# EAGLE design PixelPusherV0 (EAGLE 9.6.2)
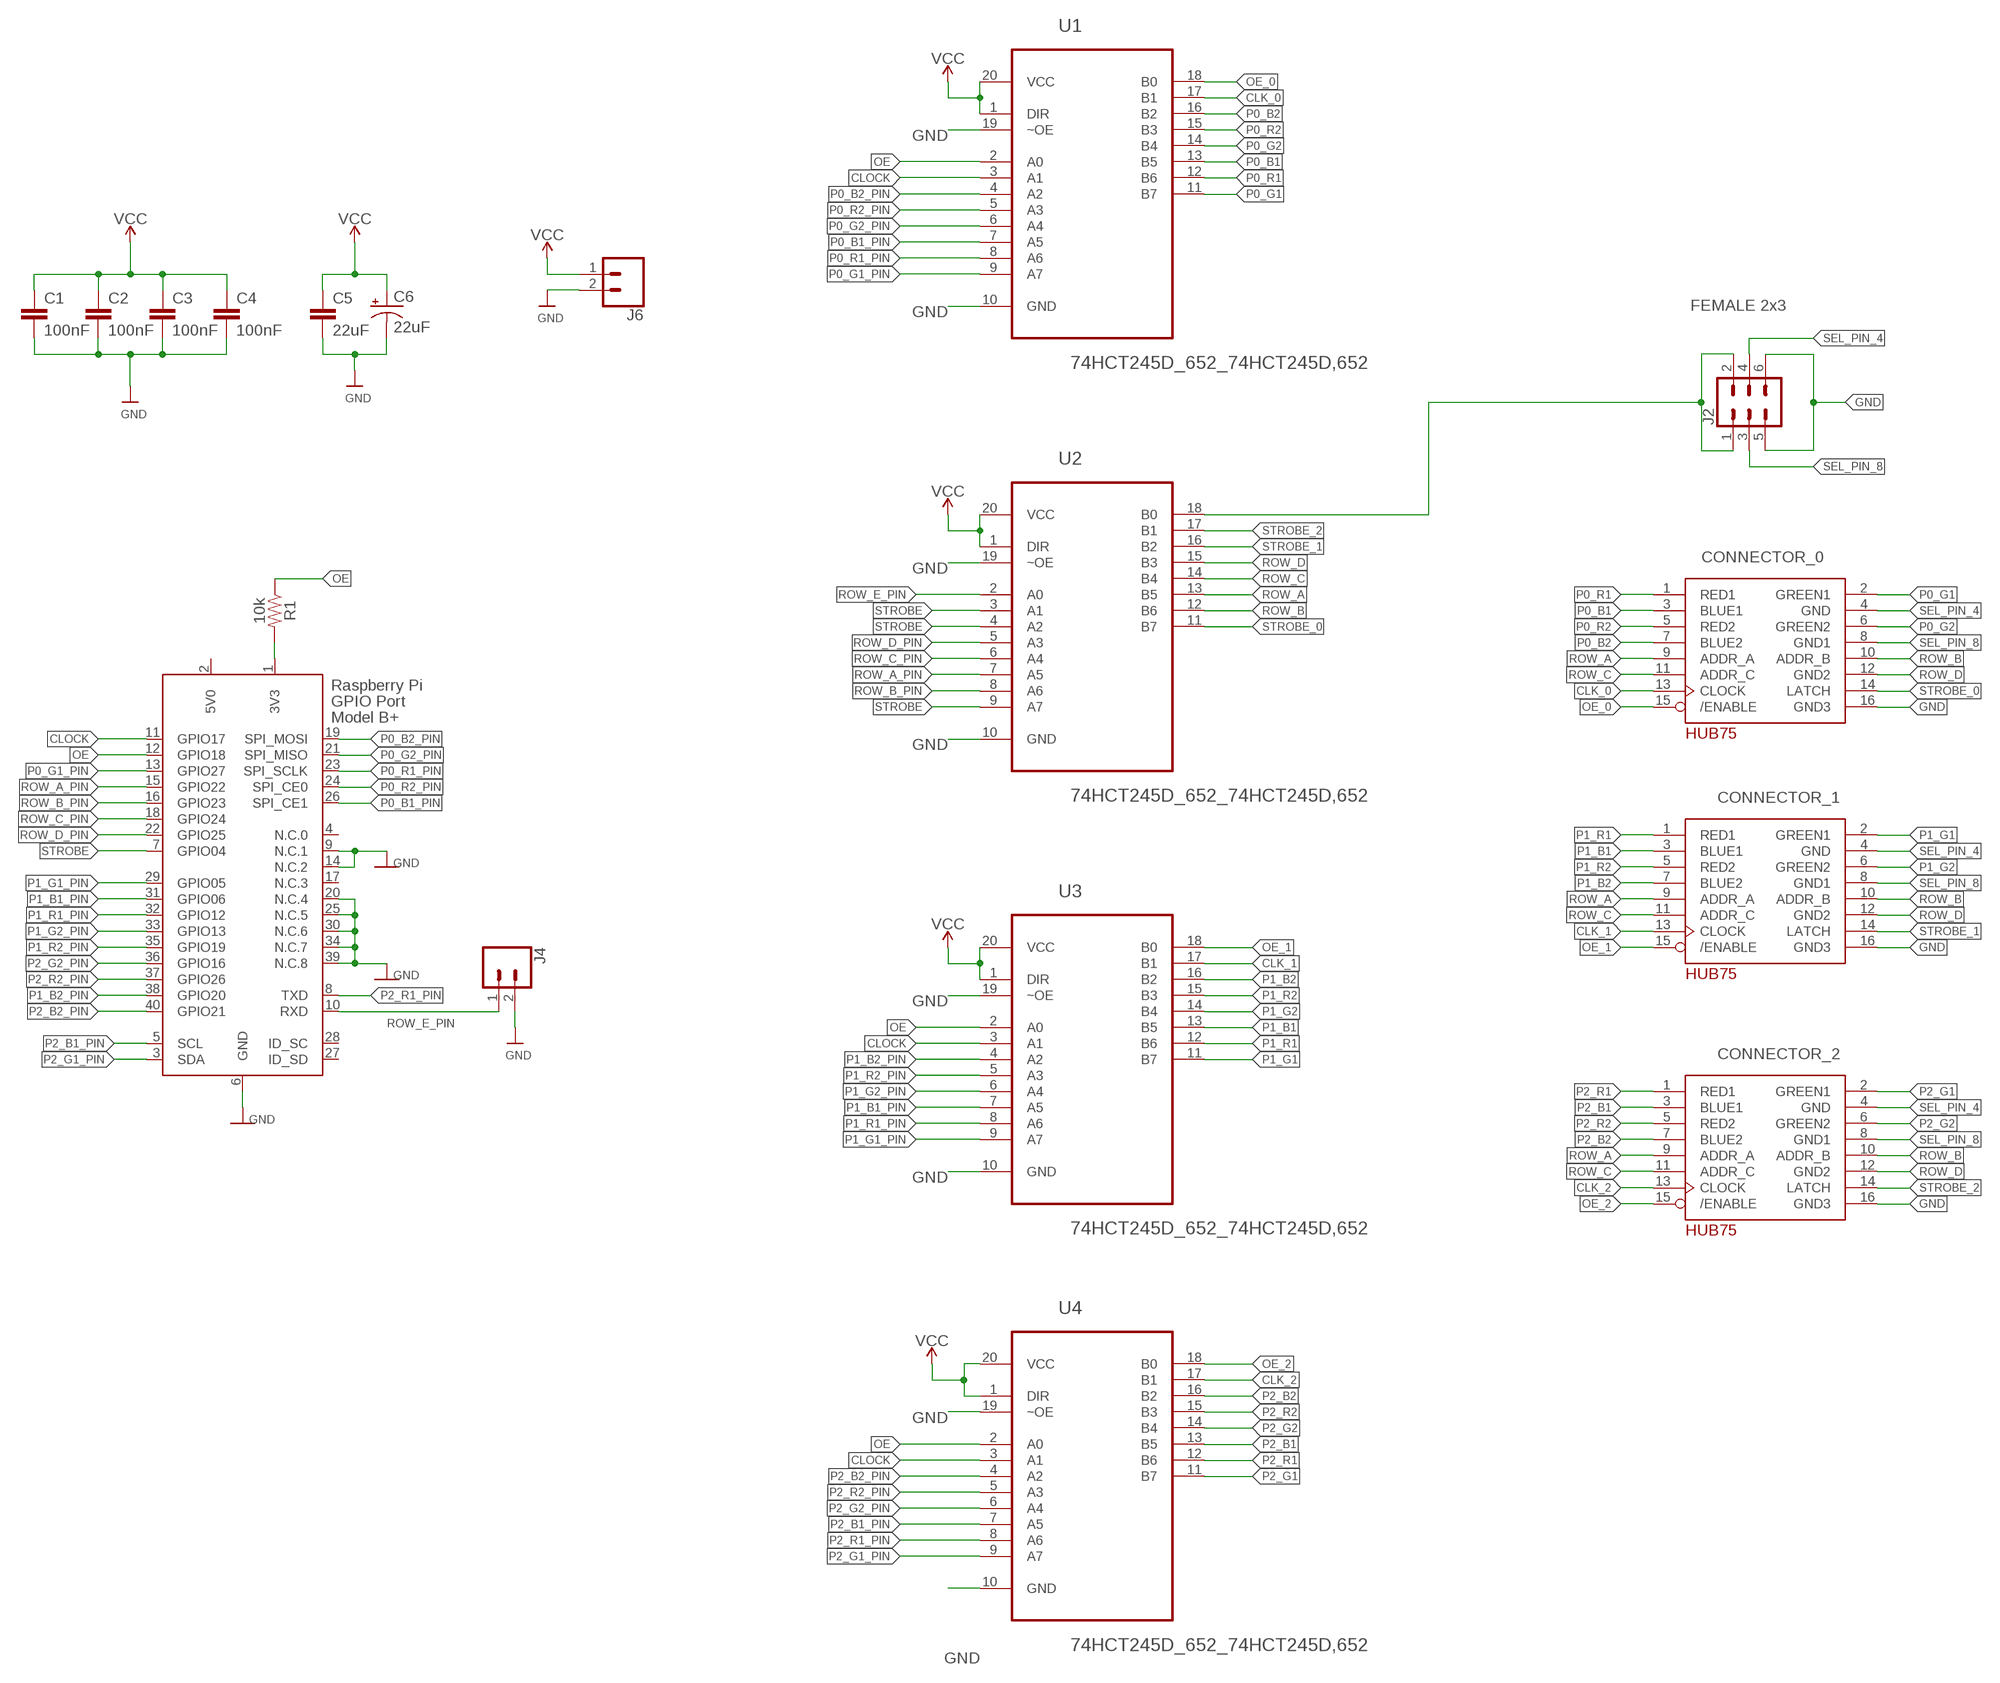
[diagram p0: schematic, sheet 1]

## Parts
C1  100nF  SPARKFUN-CAPACITORS_0.1UF-0603-25V-(+80/-20%)  [SPARKFUN-CAPACITORS_0603]
C2  100nF  SPARKFUN-CAPACITORS_0.1UF-0603-25V-(+80/-20%)  [SPARKFUN-CAPACITORS_0603]
C3  100nF  SPARKFUN-CAPACITORS_0.1UF-0603-25V-(+80/-20%)  [SPARKFUN-CAPACITORS_0603]
C4  100nF  SPARKFUN-CAPACITORS_0.1UF-0603-25V-(+80/-20%)  [SPARKFUN-CAPACITORS_0603]
C5  22uF  SPARKFUN-CAPACITORS_22UF-0805-6.3V-20%  [SPARKFUN-CAPACITORS_0805]
C6  22uF  SPARKFUN-CAPACITORS_22UF-POLAR-PANASONIC_C-35V-20%  [SPARKFUN-CAPACITORS_PANASONIC_C]
CONNECTOR_0  ADAFRUIT_HUB75MATRIX  [ADAFRUIT_2X08-IDC]
CONNECTOR_1  ADAFRUIT_HUB75MATRIX  [ADAFRUIT_2X08-IDC]
CONNECTOR_2  ADAFRUIT_HUB75MATRIX  [ADAFRUIT_2X08-IDC]
J2  FEMALE 2x3  SPARKFUN-CONNECTORS_CONN_03X2FEMALE  [SPARKFUN-CONNECTORS_2X3]
J4  SPARKFUN-CONNECTORS_CONN_02  [SPARKFUN-CONNECTORS_1X02]
J6  SPARKFUN-CONNECTORS_CONN_023.5MM_LOCK  [SPARKFUN-CONNECTORS_SCREWTERMINAL-3.5MM-2_LOCK]
R1  10k  SPARKFUN-RESISTORS_10KOHM-0603-1/10W-1%  [SPARKFUN-RESISTORS_0603:1]
U1  74HCT245D_652_74HCT245D,652  [74HCT245D_652_SOIC127P1032X265-20N]
U2  74HCT245D_652_74HCT245D,652  [74HCT245D_652_SOIC127P1032X265-20N]
U3  74HCT245D_652_74HCT245D,652  [74HCT245D_652_SOIC127P1032X265-20N]
U4  74HCT245D_652_74HCT245D,652  [74HCT245D_652_SOIC127P1032X265-20N]
X2  RASPBERRYPI_BASTELSTUBE_V13_RASPI_BOARD_B+_HD  [RASPBERRYPI_BASTELSTUBE_V13_RASPI_BOARD_B+HAT_DF]

## Nets
CLK_0: CONNECTOR_0.13(CLOCK) U1.17(B1)
CLK_1: CONNECTOR_1.13(CLOCK) U3.17(B1)
CLK_2: CONNECTOR_2.13(CLOCK) U4.17(B1)
CLOCK: U1.3(A1) U3.3(A1) U4.3(A1) X2.11(GPIO17)
GND: C1.2 C2.2 C3.2 C4.2 C5.2 C6.- CONNECTOR_0.16(GND3) CONNECTOR_1.16(GND3) CONNECTOR_2.16(GND3) J2.5 J2.6 J4.2 J6.2 U1.10(GND) U1.19(~OE) U2.10(GND) U2.19(~OE) U3.10(GND) U3.19(~OE) U4.10(GND) U4.19(~OE) X2.6(GND) X2.9(N.C.1) X2.14(N.C.2) X2.20(N.C.4) X2.25(N.C.5) X2.30(N.C.6) X2.34(N.C.7) X2.39(N.C.8)
N$1: J2.1 J2.2 U2.18(B0)
N$2: R1.2 X2.1(3V3)
OE: R1.1 U1.2(A0) U3.2(A0) U4.2(A0) X2.12(GPIO18)
OE_0: CONNECTOR_0.15(/ENABLE) U1.18(B0)
OE_1: CONNECTOR_1.15(/ENABLE) U3.18(B0)
OE_2: CONNECTOR_2.15(/ENABLE) U4.18(B0)
P0_B1: CONNECTOR_0.3(BLUE1) U1.13(B5)
P0_B1_PIN: U1.7(A5) X2.26(SPI_CE1)
P0_B2: CONNECTOR_0.7(BLUE2) U1.16(B2)
P0_B2_PIN: U1.4(A2) X2.19(SPI_MOSI)
P0_G1: CONNECTOR_0.2(GREEN1) U1.11(B7)
P0_G1_PIN: U1.9(A7) X2.13(GPIO27)
P0_G2: CONNECTOR_0.6(GREEN2) U1.14(B4)
P0_G2_PIN: U1.6(A4) X2.21(SPI_MISO)
P0_R1: CONNECTOR_0.1(RED1) U1.12(B6)
P0_R1_PIN: U1.8(A6) X2.23(SPI_SCLK)
P0_R2: CONNECTOR_0.5(RED2) U1.15(B3)
P0_R2_PIN: U1.5(A3) X2.24(SPI_CE0)
P1_B1: CONNECTOR_1.3(BLUE1) U3.13(B5)
P1_B1_PIN: U3.7(A5) X2.31(GPIO06)
P1_B2: CONNECTOR_1.7(BLUE2) U3.16(B2)
P1_B2_PIN: U3.4(A2) X2.38(GPIO20)
P1_G1: CONNECTOR_1.2(GREEN1) U3.11(B7)
P1_G1_PIN: U3.9(A7) X2.29(GPIO05)
P1_G2: CONNECTOR_1.6(GREEN2) U3.14(B4)
P1_G2_PIN: U3.6(A4) X2.33(GPIO13)
P1_R1: CONNECTOR_1.1(RED1) U3.12(B6)
P1_R1_PIN: U3.8(A6) X2.32(GPIO12)
P1_R2: CONNECTOR_1.5(RED2) U3.15(B3)
P1_R2_PIN: U3.5(A3) X2.35(GPIO19)
P2_B1: CONNECTOR_2.3(BLUE1) U4.13(B5)
P2_B1_PIN: U4.7(A5) X2.5(SCL)
P2_B2: CONNECTOR_2.7(BLUE2) U4.16(B2)
P2_B2_PIN: U4.4(A2) X2.40(GPIO21)
P2_G1: CONNECTOR_2.2(GREEN1) U4.11(B7)
P2_G1_PIN: U4.9(A7) X2.3(SDA)
P2_G2: CONNECTOR_2.6(GREEN2) U4.14(B4)
P2_G2_PIN: U4.6(A4) X2.36(GPIO16)
P2_R1: CONNECTOR_2.1(RED1) U4.12(B6)
P2_R1_PIN: U4.8(A6) X2.8(TXD)
P2_R2: CONNECTOR_2.5(RED2) U4.15(B3)
P2_R2_PIN: U4.5(A3) X2.37(GPIO26)
ROW_A: CONNECTOR_0.9(ADDR_A) CONNECTOR_1.9(ADDR_A) CONNECTOR_2.9(ADDR_A) U2.13(B5)
ROW_A_PIN: U2.7(A5) X2.15(GPIO22)
ROW_B: CONNECTOR_0.10(ADDR_B) CONNECTOR_1.10(ADDR_B) CONNECTOR_2.10(ADDR_B) U2.12(B6)
ROW_B_PIN: U2.8(A6) X2.16(GPIO23)
ROW_C: CONNECTOR_0.11(ADDR_C) CONNECTOR_1.11(ADDR_C) CONNECTOR_2.11(ADDR_C) U2.14(B4)
ROW_C_PIN: U2.6(A4) X2.18(GPIO24)
ROW_D: CONNECTOR_0.12(GND2) CONNECTOR_1.12(GND2) CONNECTOR_2.12(GND2) U2.15(B3)
ROW_D_PIN: U2.5(A3) X2.22(GPIO25)
ROW_E_PIN: J4.1 U2.2(A0) X2.10(RXD)
SEL_PIN_4: CONNECTOR_0.4(GND) CONNECTOR_1.4(GND) CONNECTOR_2.4(GND) J2.4
SEL_PIN_8: CONNECTOR_0.8(GND1) CONNECTOR_1.8(GND1) CONNECTOR_2.8(GND1) J2.3
STROBE: U2.3(A1) U2.4(A2) U2.9(A7) X2.7(GPIO04)
STROBE_0: CONNECTOR_0.14(LATCH) U2.11(B7)
STROBE_1: CONNECTOR_1.14(LATCH) U2.16(B2)
STROBE_2: CONNECTOR_2.14(LATCH) U2.17(B1)
VCC: C1.1 C2.1 C3.1 C4.1 C5.1 C6.+ J6.1 U1.1(DIR) U1.20(VCC) U2.1(DIR) U2.20(VCC) U3.1(DIR) U3.20(VCC) U4.1(DIR) U4.20(VCC)
Unconnected: X2.4(N.C.0) X2.17(N.C.3) X2.27(ID_SD) X2.28(ID_SC)

## Power pins joined to a net without a drawn wire
5V0: X2.2(5V0)

## Library data of the parts
C1-C4 = PixelPusherV0:SPARKFUN-CAPACITORS_0.1UF: 0.1µF ceramic capacitors A capacitor is a passive two-terminal electrical component used to store electrical energy temporarily in an electric field.; PROD_ID: CAP-00810; VALUE: 0.1uF
C5 = PixelPusherV0:SPARKFUN-CAPACITORS_22UF: 22µF ceramic capacitors A capacitor is a passive two-terminal electrical component used to store electrical energy temporarily in an electric field.; PROD_ID: CAP-08402
C6 = PixelPusherV0:SPARKFUN-CAPACITORS_22UF-POLAR: 22µF polarized capacitors A capacitor is a passive two-terminal electrical component used to store electrical energy temporarily in an electric field.; PROD_ID: CAP-08618
CONNECTOR_0 CONNECTOR_1 CONNECTOR_2 = PixelPusherV0:ADAFRUIT_HUB75MATRIX
J2 = PixelPusherV0:SPARKFUN-CONNECTORS_CONN_03X2: Multi connection point. Often used as Generic Header-pin footprint for 0.1 inch spaced/style header connections You can populate with any combo of single row headers, but if you'd like an exact match, check these: Header - 2x3 (Male, 0.1") <https://www.sparkfun.com/products/12807> (PRT-12807) Header - 2x3 (Female, 0.1") <https://www.sparkfun.com/products/13010> (PRT-13010) 2x3 Pin Shrouded Header <https://www.sparkfun.com/products/10877> (PRT-10877) On any of the 0.1 inch spaced packages, you can populate with these: Break Away Headers - Straight <https://www.sparkfun.com/products/116> (PRT-00116) Break Away Male Headers - Right Angle <https://www.sparkfun.com/products/553> (PRT-00553) Female Headers <https://www.sparkfun.com/products/115> (PRT-00115) Break Away Headers - Machine Pin <https://www.sparkfun.com/products/117> (PRT-00117) Break Away Female Headers - Swiss Machine Pin <https://www.sparkfun.com/products/743> (PRT-00743) Special note: the shrouded connector mates well with our 3x2 ribbon cables: Ribbon Crimp Connector - 6-pin (2x3, Female) <https://www.sparkfun.com/products/10651> (PRT-10651) Ribbon Cable - 6 wire (15ft) <https://www.sparkfun.com/products/10646> (PRT-10646); PROD_ID: CONN-11566
J4 = PixelPusherV0:SPARKFUN-CONNECTORS_CONN_02: Multi connection point. Often used as Generic Header-pin footprint for 0.1 inch spaced/style header connections On any of the 0.1 inch spaced packages, you can populate with these: Break Away Headers - Straight <https://www.sparkfun.com/products/116> (PRT-00116) Break Away Male Headers - Right Angle <https://www.sparkfun.com/products/553> (PRT-00553) Female Headers <https://www.sparkfun.com/products/115> (PRT-00115) Break Away Headers - Machine Pin <https://www.sparkfun.com/products/117> (PRT-00117) Break Away Female Headers - Swiss Machine Pin <https://www.sparkfun.com/products/743> (PRT-00743) For SCREWTERMINALS and SPRING TERMINALS visit here: Screw Terimnals on SparkFun.com <https://www.sparkfun.com/search/results?term=Screw+Terminals> (5mm/3.5mm/2.54mm spacing) This device is also useful as a general connection point to wire up your design to another part of your project. Our various solder wires solder well into these plated through hole pads. Hook-Up Wire - Assortment (Stranded, 22 AWG) <https://www.sparkfun.com/products/11375> (PRT-11375) Hook-Up Wire - Assortment (Solid Core, 22 AWG) <https://www.sparkfun.com/products/11367> (PRT-11367) View the entire wire category on our website here <https://www.sparkfun.com/categories/141> Special notes: Molex polarized connector foot print use with: PRT-08233 with associated crimp pins and housings. 2.54_SCREWTERM for use with PRT-10571. 3.5mm Screw Terminal footprints for PRT-08084 5mm Screw Terminal footprints for use with PRT-08432
J6 = PixelPusherV0:SPARKFUN-CONNECTORS_CONN_02: Multi connection point. Often used as Generic Header-pin footprint for 0.1 inch spaced/style header connections On any of the 0.1 inch spaced packages, you can populate with these: Break Away Headers - Straight <https://www.sparkfun.com/products/116> (PRT-00116) Break Away Male Headers - Right Angle <https://www.sparkfun.com/products/553> (PRT-00553) Female Headers <https://www.sparkfun.com/products/115> (PRT-00115) Break Away Headers - Machine Pin <https://www.sparkfun.com/products/117> (PRT-00117) Break Away Female Headers - Swiss Machine Pin <https://www.sparkfun.com/products/743> (PRT-00743) For SCREWTERMINALS and SPRING TERMINALS visit here: Screw Terimnals on SparkFun.com <https://www.sparkfun.com/search/results?term=Screw+Terminals> (5mm/3.5mm/2.54mm spacing) This device is also useful as a general connection point to wire up your design to another part of your project. Our various solder wires solder well into these plated through hole pads. Hook-Up Wire - Assortment (Stranded, 22 AWG) <https://www.sparkfun.com/products/11375> (PRT-11375) Hook-Up Wire - Assortment (Solid Core, 22 AWG) <https://www.sparkfun.com/products/11367> (PRT-11367) View the entire wire category on our website here <https://www.sparkfun.com/categories/141> Special notes: Molex polarized connector foot print use with: PRT-08233 with associated crimp pins and housings. 2.54_SCREWTERM for use with PRT-10571. 3.5mm Screw Terminal footprints for PRT-08084 5mm Screw Terminal footprints for use with PRT-08432; PROD_ID: CONN-08399
R1 = PixelPusherV0:SPARKFUN-RESISTORS_10KOHM: 10kΩ resistor A resistor is a passive two-terminal electrical component that implements electrical resistance as a circuit element. Resistors act to reduce current flow, and, at the same time, act to lower voltage levels within circuits. - Wikipedia; PROD_ID: RES-00824
U1-U4 = PixelPusherV0:74HCT245D_652_74HCT245D,652: Octal bus transceiver Check prices <https://pricing.snapeda.com/parts/74HCT245D%2C652/Nexperia/view-part?ref=eda>; AVAILABILITY: In Stock; DESCRIPTION: Transceiver, Non-Inverting 1 Element 8 Bit per Element 3-State Output 20-SO; MF: Nexperia; MP: 74HCT245D,652; PACKAGE: SO20-20 Nexperia USA Inc.; PRICE: None
X2 = PixelPusherV0:RASPBERRYPI_BASTELSTUBE_V13_RASPI_BOARD_B+: Raspberry Pi GPIO connector with markings for the outer dimensions of the Raspberry Pi board model B+ with different sets of drill holes or mounting pads

## Board
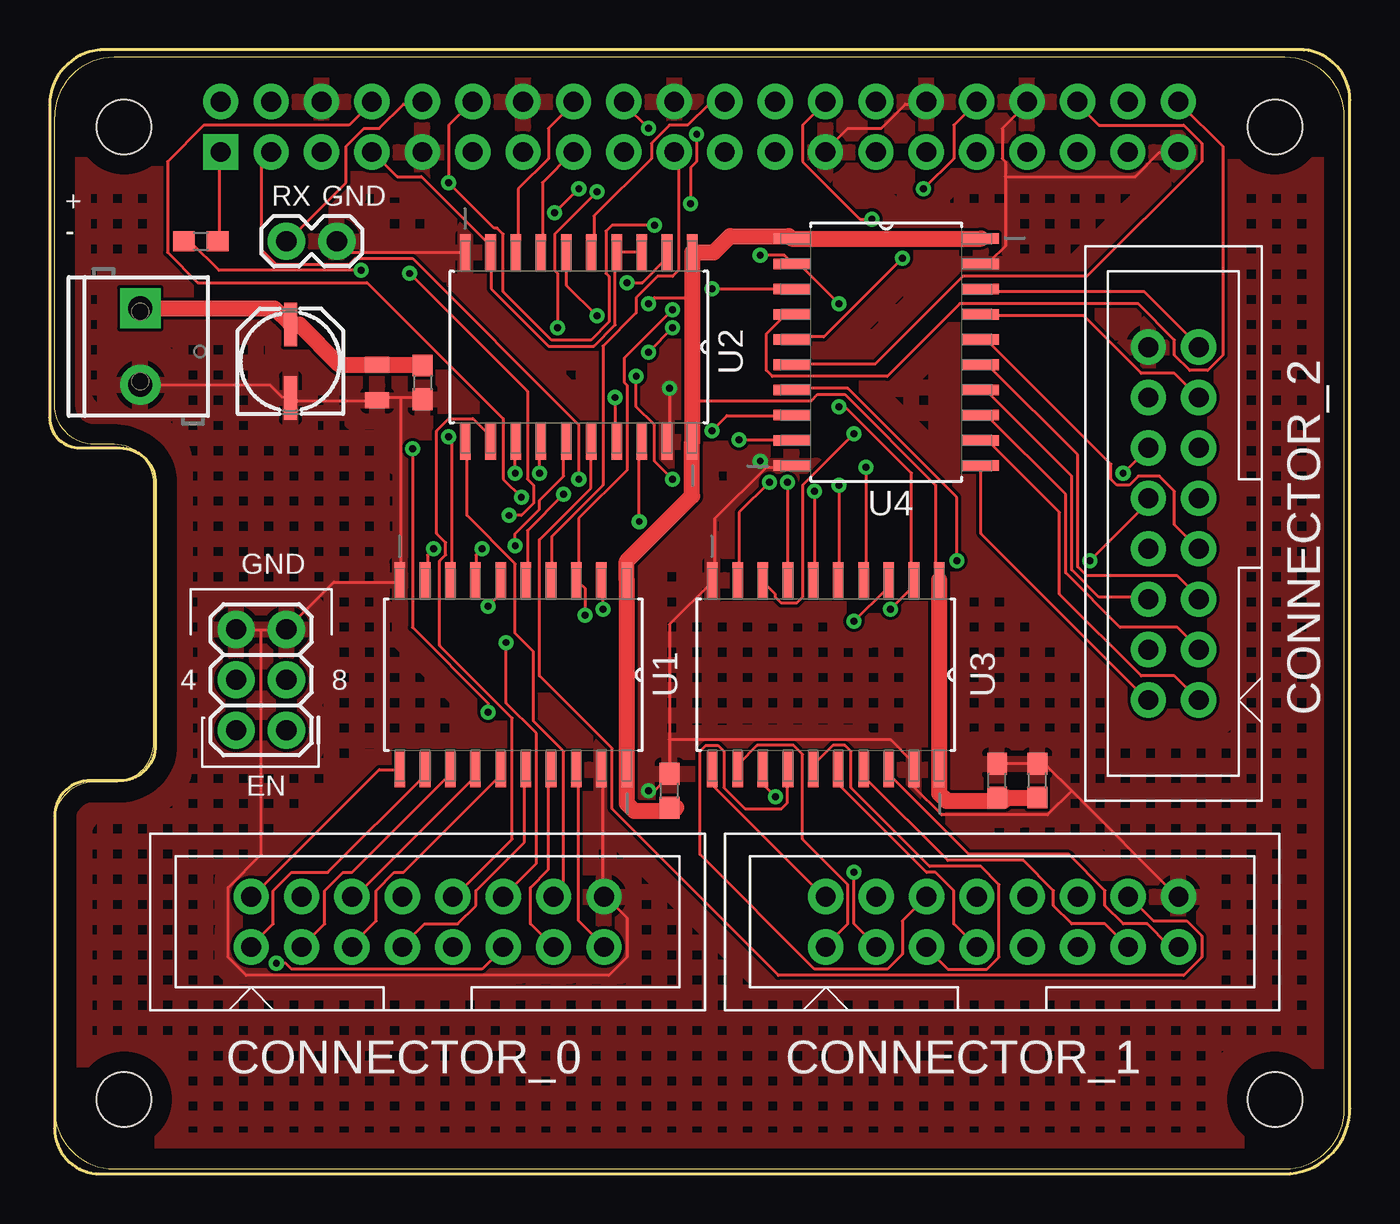
[diagram p1: board, top side]
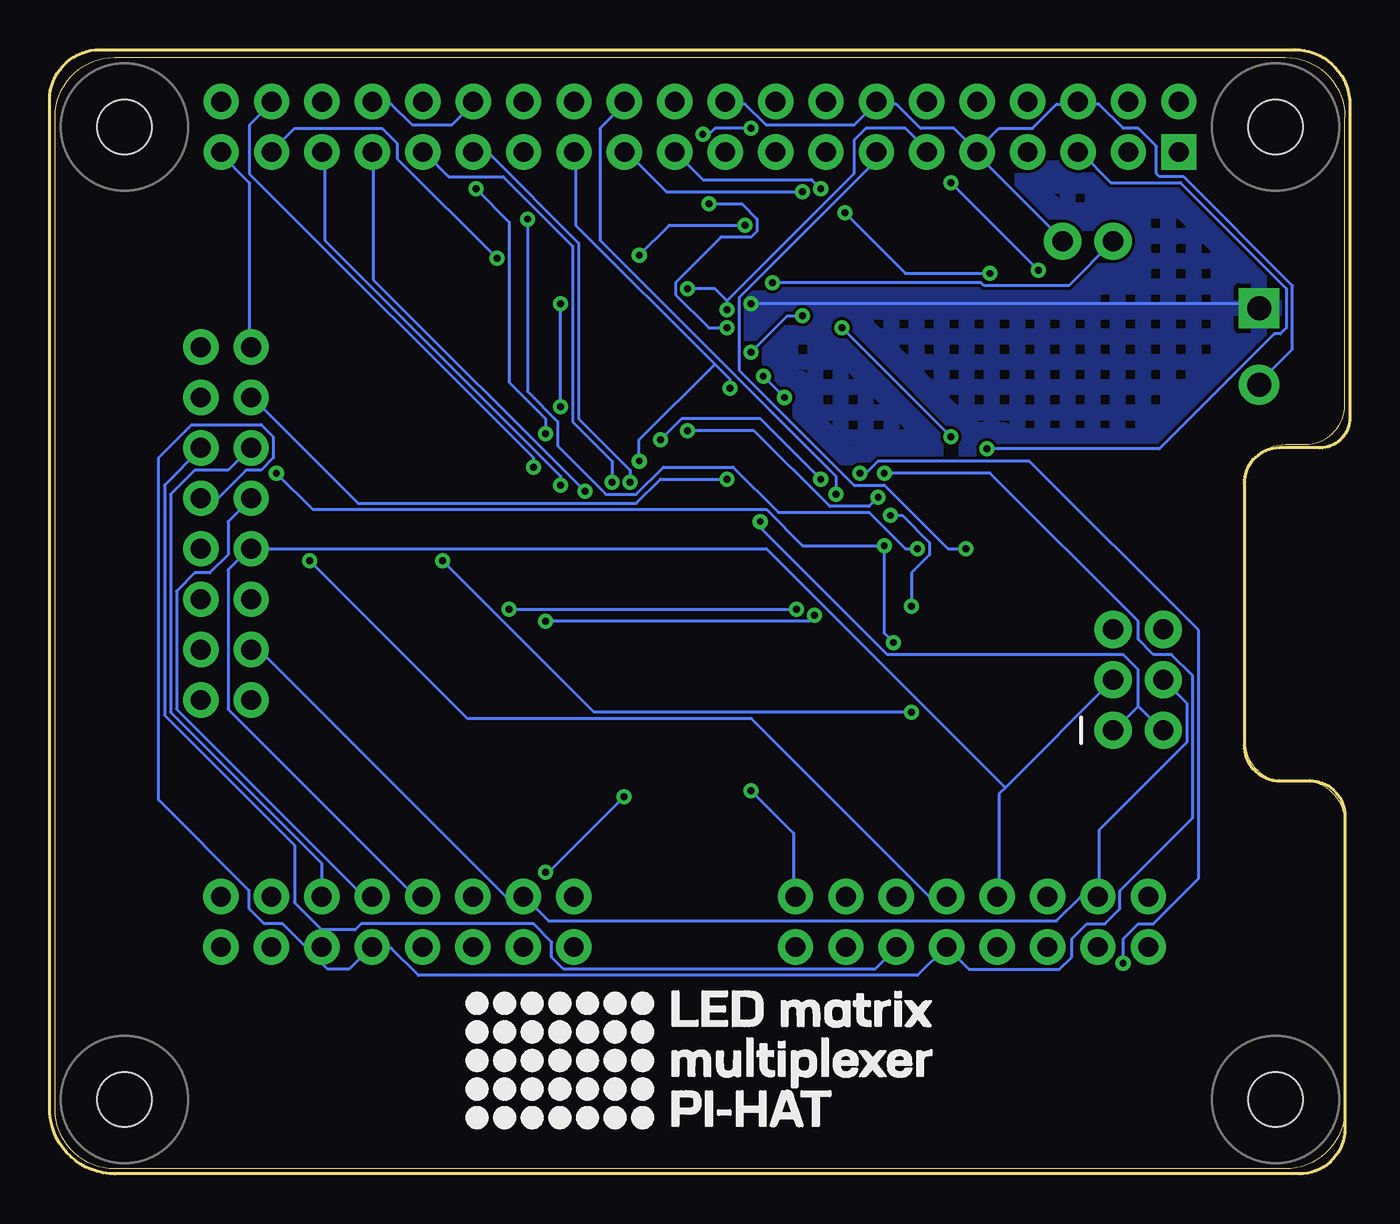
[diagram p2: board, bottom side, seen from below]

Size 65.53 x 56.64 mm. Coordinates in mm from the lower left corner, seen from the top.
Outline: 2.54,0 62.23,0 arc90 65.53,3.3 65.53,54.1 arc90 62.99,56.64 2.79,56.64 arc90 0,53.85 0,38.1 arc90 1.52,36.58 3.56,36.58 arc-90 5.33,34.8 5.33,21.59 arc-90 3.56,19.81 2.03,19.81 arc90 0.25,18.03 0.25,2.29 arc90 2.54,0
Copper layers (1*16): Top 0.035mm / dielectric 1.5mm / Bottom 0.035mm
Design rules "default *": minimum track width 6mil, minimum drill 0.35mm, track to track 6mil, track to pad 6mil, pad to pad 6mil, via to via 6mil, smd to smd 6mil, copper to edge 40mil, drill to drill 6mil, minimum pad ring 10mil, minimum via ring 8mil, stop-mask expansion 4mil, vias tented up to drill 0.35mm, thermal gap 10mil

### Footprints (pad centres in the part's own frame; a part is rotated, then mirrored left to right if it is on the bottom)
SPARKFUN-CAPACITORS_0603 = smd 1.1 x 1: 1 -0.85,0; 2 0.85,0
SPARKFUN-CAPACITORS_0805 = smd 0.8 x 1.2: 1 -0.9,0; 2 0.9,0
SPARKFUN-CAPACITORS_PANASONIC_C = smd 2.2 x 0.65: + 1.9,-0.2; - -1.8,-0.2
ADAFRUIT_2X08-IDC = drill 1 pad 1.778: 1 -1.27,8.89; 2 1.27,8.89; 3 -1.27,6.35; 4 1.27,6.35; 5 -1.27,3.81; 6 1.27,3.81; 7 -1.27,1.27; 8 1.27,1.27; 9 -1.27,-1.27; 10 1.27,-1.27; 11 -1.27,-3.81; 12 1.27,-3.81; 13 -1.27,-6.35; 14 1.27,-6.35; 15 -1.27,-8.89; 16 1.27,-8.89
SPARKFUN-CONNECTORS_2X3 = drill 1.016 pad 1.88: 1 0,0; 2 0,2.54; 3 2.54,0; 4 2.54,2.54; 5 5.08,0; 6 5.08,2.54
SPARKFUN-CONNECTORS_1X02 = drill 1.016 pad 1.88: 1 0,0; 2 2.54,0
SPARKFUN-CONNECTORS_SCREWTERMINAL-3.5MM-2_LOCK = drill 1.2 pad 2.032 square: 1 -0.178,0 | drill 1.2 pad 2.032: 2 3.678,0
SPARKFUN-RESISTORS_0603:1 = smd 1.1 x 1: 1 -0.85,0; 2 0.85,0
74HCT245D_652_SOIC127P1032X265-20N = smd 1.803 x 0.533: 1 -4.775,5.715; 2 -4.775,4.445; 3 -4.775,3.175; 4 -4.775,1.905; 5 -4.775,0.635; 6 -4.775,-0.635; 7 -4.775,-1.905; 8 -4.775,-3.175; 9 -4.775,-4.445; 10 -4.775,-5.715; 11 4.775,-5.715; 12 4.775,-4.445; 13 4.775,-3.175; 14 4.775,-1.905; 15 4.775,-0.635; 16 4.775,0.635; 17 4.775,1.905; 18 4.775,3.175; 19 4.775,4.445; 20 4.775,5.715
RASPBERRYPI_BASTELSTUBE_V13_RASPI_BOARD_B+HAT_DF = drill 1 pad 1.778 square: 1 8.37,51.23 | drill 1 pad 1.778: 2 8.37,53.77; 3 10.91,51.23; 4 10.91,53.77; 5 13.45,51.23; 6 13.45,53.77; 7 15.99,51.23; 8 15.99,53.77; 9 18.53,51.23; 10 18.53,53.77; 11 21.07,51.23; 12 21.07,53.77; 13 23.61,51.23; 14 23.61,53.77; 15 26.15,51.23; 16 26.15,53.77; 17 28.69,51.23; 18 28.69,53.77; 19 31.23,51.23; 20 31.23,53.77; 21 33.77,51.23; 22 33.77,53.77; 23 36.31,51.23; 24 36.31,53.77; 25 38.85,51.23; 26 38.85,53.77; 27 41.39,51.23; 28 41.39,53.77; 29 43.93,51.23; 30 43.93,53.77; 31 46.47,51.23; 32 46.47,53.77; 33 49.01,51.23; 34 49.01,53.77; 35 51.55,51.23; 36 51.55,53.77; 37 54.09,51.23; 38 54.09,53.77; 39 56.63,51.23; 40 56.63,53.77 | hole 2.75: 3.5,3.5; 3.5,52.5; 61.5,3.5; 61.5,52.5

### Placement (x,y rotation side)
C1  31.24,19.3 90 top
C2  18.8,39.88 270 top
C3  47.75,19.81 90 top
C4  49.78,19.81 90 top
C5  16.51,39.88 270 top
C6  11.94,40.89 90 top
CONNECTOR_0  19.05,12.7 90 top
CONNECTOR_1  48.01,12.7 90 top
CONNECTOR_2  56.64,32.77 180 top
J2  11.94,22.35 90 top
J4  11.94,46.99 0 top
J6  4.57,43.43 270 top
R1  7.62,46.99 0 top
U1  23.37,25.15 270 top
U2  26.67,41.66 270 top
U3  39.12,25.15 270 top
U4  42.16,41.4 0 top
X2  0.25,0.25 0 top

### Tracks (layer width: path | path; a pad name or v marks a point on that pad's centre or on a via)
CLK_0
  Top 0.152: CONNECTOR_0.13 24.23,12.6 24.23,14.43 25.15,15.34 25.15,20.37 U1.17
CLK_1
  Top 0.152: CONNECTOR_1.13 53.19,12.6 51.51,12.6 50.6,13.51 50.6,14.28 49.07,15.8 45.26,15.8 41.15,19.91 41.15,20.37 U3.17
CLK_2
  Top 0.152: CONNECTOR_2.13 56.69,40.34 55.02,40.34 52.12,43.23 46.94,43.23 U4.17
CLOCK  (via drill 0.35)
  Top 0.152: v31.39,43.54 28.96,41.1 28.96,39.88 29.11,39.73 29.11,35.46 26.67,33.02 26.67,29.97 U1.3 26.67,29.82 26.98,29.52 v26.98,28.14 | v33.38,44.6 37.34,44.6 U4.3 | v40.54,27.84 42.22,29.52 42.22,29.82 U3.3
  Bottom 0.152: 31.39,43.99 v31.39,43.54 | 31.39,43.99 24.99,50.39 24.99,52.07 24.38,52.68 22.4,52.68 21.34,51.61 X2.11 | v33.38,44.6 32,44.6 31.39,43.99 | v40.54,27.84 27.28,27.84 v26.98,28.14
GND  (via drill 0.35)
  Top 0.152: U2.10 14.94,46.43 14.48,46.89 J4.2 | 10.67,27.38 11.89,27.38 J2.5 14.33,29.82 17.53,29.82 U1.10 17.68,29.97 17.68,39.12 | 10.67,27.38 9.45,27.38 J2.6 | 17.68,39.12 16.61,39.12 C5.2 16.46,38.96 12.14,38.96 C6.- 11.69,39.16 11.12,39.73 4.57,39.73 J6.2 | 17.68,39.12 18.75,39.12 C2.2 | 48.16,50.24 48.16,51 48.01,51.16 48.01,52.68 49.23,53.9 X2.34 | 48.16,50.24 48.16,46.74 47.4,45.97 46.94,45.97 U4.19 | v31.24,39.57 31.24,36.98 U2.19 | X2.30 44.04,53.9 43.13,53.9 41.91,52.68 40.23,52.68 39.17,51.61 X2.25 | 48.16,50.24 54.71,50.24 55.93,51.46 56.84,51.46 X2.39 | C3.2 47.85,20.68 49.68,20.68 C4.2 49.84,20.52 50.29,20.52 51.51,19.3 | 51.51,19.3 56.84,13.97 CONNECTOR_1.16 | 51.51,19.3 50.29,18.09 44.96,18.09 43.59,19.46 43.59,20.37 U3.19 43.43,20.37 43.43,20.83 42.37,21.89 31.24,21.89 | U1.19 27.89,20.37 27.89,13.97 CONNECTOR_0.16 28.04,13.97 29.11,12.9 29.11,10.92 28.19,10.01 9.91,10.01 8.99,10.92 8.99,14.43 10.67,16.1 10.67,27.38 | 31.24,21.89 31.24,27.69 33.38,29.82 U3.10 33.53,29.97 33.53,33.02 36.12,35.61 | 31.24,21.89 C1.2 31.24,20.07 30.48,19.3 v30.17,19.3 | 36.12,35.61 37.34,35.61 U4.10 | 36.12,35.61 v35.81,35.92
  Bottom 0.152: X2.9 18.75,51.61 17.68,52.68 16,52.68 14.78,53.9 13.72,53.9 X2.6 13.56,53.9 12.65,53.9 11.43,52.68 10.67,52.68 9.75,51.77 9.75,50.39 9.6,50.24 8.38,50.24 2.9,44.76 2.9,41.55 4.57,39.88 J6.2 | X2.9 18.9,51.61 19.96,52.68 21.64,52.68 22.86,53.9 23.77,53.9 X2.14 23.93,53.9 24.99,52.83 29.41,52.83 30.48,53.9 31.39,53.9 X2.20 | J4.2 14.48,47.04 18.9,51.46 X2.9 | CONNECTOR_2.16 55.47,41.71 55.47,49.94 57,51.46 X2.39 | v31.24,39.57 31.24,40.03 32,40.79 | 32,40.79 39.01,47.8 39.01,51.46 X2.25 | X2.34 49.23,53.9 48.31,53.9 47.24,52.83 45.26,52.83 44.2,53.9 X2.30 | v30.17,19.3 28.04,17.17 28.04,13.97 CONNECTOR_0.16 | 32,40.79 35.81,36.98 v35.81,35.92
  pour Top (hatched): -7.11,56.64 -7.11,-1.78 -3.56,-5.33 70.1,-5.33 71.63,-3.81 74.42,-1.02 74.42,59.94 69.6,64.77 -0.51,64.77 -5.08,64.77 -6.1,63.75 -7.11,62.74
N$1  (via drill 0.35)
  Top 0.152: v29.72,32.87 29.72,36.83 U2.18
  Bottom 0.152: v29.72,32.87 29.72,32.56 23.32,26.16 11.43,26.16 10.67,25.4 10.67,23.57 | 10.67,23.57 9.45,22.35 J2.2 | 10.67,23.57 11.89,22.35 J2.1
N$2
  Top 0.152: R1.2 8.53,47.04 8.53,51.46 X2.1
OE  (via drill 0.35)
  Top 0.152: v15.7,45.52 8.53,45.52 7.16,46.89 6.86,46.89 R1.1 | X2.12 21.18,53.9 20.12,52.83 v20.12,49.94 22.4,47.65 22.56,47.65 22.86,47.35 22.86,44.45 25.3,42.01 27.28,42.01 28.19,42.93 28.19,45.21 28.04,45.36 28.04,47.5 28.35,47.8 v30.48,47.8 | v27.89,28.45 27.89,29.82 U1.2 | v42.37,28.45 43.43,29.52 43.43,29.82 U3.2 43.43,29.97 43.43,35.31 40.08,38.66 v39.78,38.66 | v39.78,43.84 37.8,45.82 37.49,45.82 U4.2 37.34,45.97 37.03,46.28 v35.81,46.28
  Bottom 0.152: v20.12,49.94 v15.7,45.52 | v42.37,28.45 v27.89,28.45 | v39.78,38.66 v39.78,43.84 | v30.48,47.8 34.29,47.8 v35.81,46.28
OE_0
  Top 0.152: U1.18 26.67,20.37 26.67,12.75 27.89,11.53 CONNECTOR_0.15
OE_1
  Top 0.152: U3.18 42.37,20.37 42.37,20.07 46.33,16.1 51.36,16.1 53.19,14.28 53.19,13.51 54.1,12.6 55.32,12.6 56.39,11.53 56.84,11.53 CONNECTOR_1.15
OE_2
  Top 0.152: U4.18 46.94,44.45 55.17,44.45 57.91,41.71 CONNECTOR_2.15
P0_B1
  Top 0.152: CONNECTOR_0.3 13.87,12.6 13.87,14.28 14.78,15.19 15.24,15.19 20.12,20.07 20.12,20.37 U1.13
P0_B1_PIN  (via drill 0.35)
  Top 0.152: v21.79,31.5 21.49,31.19 21.49,29.97 U1.7 | v41.45,48.11 40.84,48.11 37.95,51 37.95,52.83 39.01,53.9 X2.26
  Bottom 0.152: v21.79,31.5 22.4,31.5 24.23,33.33 28.8,33.33 31.09,35.61 34.59,35.61 35.97,34.24 37.49,34.24 39.93,36.68 39.93,37.9 41.45,39.42 v41.45,48.11
P0_B2
  Top 0.152: U1.16 23.93,20.37 23.93,16.71 21.49,14.28 21.49,13.51 20.57,12.6 18.9,12.6 17.83,11.53 CONNECTOR_0.7
P0_B2_PIN
  Top 0.152: U1.4 25.3,29.97 25.3,32.11 27.89,34.7 27.89,41.71 29.57,43.38 29.57,44.15 30.63,45.21 31.39,45.21 31.7,45.52 31.7,51.31 31.55,51.46 X2.19
P0_G1
  Top 0.152: U1.11 16.61,20.37 10.21,13.97 CONNECTOR_0.2
P0_G1_PIN  (via drill 0.35)
  Top 0.152: v19.36,31.5 19.05,31.19 19.05,29.97 U1.9
  Bottom 0.152: v19.36,31.5 20.27,31.5 23.47,34.7 24.99,34.7 30.78,40.49 30.78,44.15 23.93,51 23.93,51.46 X2.13
P0_G2
  Top 0.152: CONNECTOR_0.6 15.39,13.97 21.34,19.91 21.34,20.37 U1.14
P0_G2_PIN  (via drill 0.35)
  Top 0.152: v22.1,28.6 22.71,29.21 22.71,29.82 U1.6 | v23.17,33.17 23.77,33.17 24.38,33.78 24.38,34.7 24.08,35 24.08,39.42 v18.14,45.36 | v26.67,49.63 v25.45,48.41
  Bottom 0.152: v22.1,28.6 22.1,30.28 21.18,31.19 21.18,31.8 22.56,33.17 v23.17,33.17 | v18.14,45.36 22.4,45.36 v25.45,48.41 | v26.67,49.63 27.13,50.09 32.61,50.09 33.98,51.46 X2.21
P0_R1
  Top 0.152: U1.12 18.9,20.37 18.9,20.07 14.02,15.19 12.19,15.19 11.28,14.28 11.28,12.6 10.21,11.53 CONNECTOR_0.1
P0_R1_PIN  (via drill 0.35)
  Top 0.152: v20.12,37.13 20.27,36.98 20.27,29.97 U1.8 | v25.6,42.62 25.6,45.36 25.45,45.52 25.45,47.35 v27.58,49.48
  Bottom 0.152: v25.6,42.62 v20.12,37.13 | v27.58,49.48 34.44,49.48 36.42,51.46 X2.23
P0_R2
  Top 0.152: U1.15 22.71,20.37 22.71,20.07 17.83,15.19 17.37,15.19 16.46,14.28 16.46,12.75 15.24,11.53 CONNECTOR_0.5
P0_R2_PIN  (via drill 0.35)
  Top 0.152: v25.91,34.24 24.08,32.41 24.08,29.97 U1.5
  Bottom 0.152: v25.91,34.24 25.91,35.15 37.8,47.04 37.8,52.68 36.58,53.9 X2.24
P1_B1  (via drill 0.35)
  Top 0.152: v36.58,19 35.97,19.61 35.97,20.37 U3.13 | v40.54,15.19 40.54,12.6 41.61,11.53 CONNECTOR_1.3
  Bottom 0.152: v36.58,19 40.39,15.19 v40.54,15.19
P1_B1_PIN  (via drill 0.35)
  Top 0.152: v37.19,34.85 37.19,29.97 U3.7
  Bottom 0.152: v37.19,34.85 37.19,35.92 39.17,37.9 39.17,46.74 42.67,50.24 45.42,50.24 46.63,51.46 X2.31
P1_B2
  Top 0.152: CONNECTOR_1.7 45.57,12.6 45.57,14.28 44.65,15.19 44.2,15.19 39.78,19.61 39.78,20.37 U3.16
P1_B2_PIN  (via drill 0.35)
  Top 0.152: v41.15,35.61 41.15,29.97 U3.4
  Bottom 0.152: v41.15,35.61 41.15,36.07 55.47,50.39 55.47,52.83 54.41,53.9 X2.38
P1_G1
  Top 0.152: U3.11 33.53,20.37 33.53,19.46 39.01,13.97 CONNECTOR_1.2
P1_G1_PIN  (via drill 0.35)
  Top 0.152: v36.27,34.85 34.75,33.33 34.75,29.97 U3.9
  Bottom 0.152: v36.27,34.85 36.27,35.46 38.86,38.05 38.86,46.89 43.43,51.46 44.04,51.46 X2.29
P1_G2
  Top 0.152: CONNECTOR_1.6 42.98,12.75 42.98,11.07 42.22,10.31 38.56,10.31 32.77,16.1 32.77,21.29 33.07,21.59 33.68,21.59 33.98,21.29 33.98,19.46 35.05,18.39 36.88,18.39 37.19,18.69 37.19,20.37 U3.14
P1_G2_PIN  (via drill 0.35)
  Top 0.152: v38.56,34.39 38.56,29.97 U3.6
  Bottom 0.152: v38.56,34.39 49.23,45.06 49.23,51.46 X2.33
P1_R1
  Top 0.152: U3.12 34.75,20.37 34.75,20.68 35.66,21.59 37.49,21.59 37.95,21.13 37.95,16.87 40.23,14.58 40.23,12.6 39.17,11.53 CONNECTOR_1.1
P1_R1_PIN  (via drill 0.35)
  Top 0.152: v40.54,37.29 37.95,34.7 37.95,29.06 37.64,28.75 36.88,28.75 36.58,29.06 36.58,29.21 35.97,29.82 U3.8 | v44.04,49.63 45.57,51.16 45.57,52.83 46.63,53.9 X2.32
  Bottom 0.152: v40.54,37.29 40.54,38.05 42.37,39.88 42.37,47.95 v44.04,49.63
P1_R2
  Top 0.152: U3.15 38.56,20.37 38.56,20.68 39.47,21.59 40.08,21.59 40.39,21.29 40.39,19.46 44.35,15.49 46.94,15.49 47.85,14.58 47.85,10.92 47.24,10.31 45.26,10.31 44.2,11.38 CONNECTOR_1.5
P1_R2_PIN  (via drill 0.35)
  Top 0.152: v39.78,34.7 39.78,29.97 U3.5
  Bottom 0.152: v39.78,34.7 39.78,35.15 51.66,47.04 51.66,51.46 X2.35
P2_B1
  Top 0.152: U4.13 46.94,38.2 47.24,38.2 51.21,34.24 51.21,30.28 53.95,27.53 56.84,27.53 57.91,26.47 CONNECTOR_2.3
P2_B1_PIN  (via drill 0.35)
  Top 0.152: v45.72,30.89 45.72,34.09 40.23,39.57 37.49,39.57 U4.7 | v22.1,23.27 22.1,23.72 18.29,27.53 v18.29,36.52
  Bottom 0.152: v45.72,30.89 38.1,23.27 v22.1,23.27 | v18.29,36.52 9.6,36.52 3.81,42.32 3.51,42.32 3.2,42.62 3.2,44.6 8.53,49.94 12.04,49.94 13.56,51.46 X2.5
P2_B2
  Top 0.152: CONNECTOR_2.7 56.69,32.72 56.69,34.39 55.93,35.15 54.86,35.15 54.41,34.7 53.8,34.7 53.49,35 53.49,35.76 47.24,42.01 46.94,42.01 U4.16
P2_B2_PIN
  Top 0.152: U4.4 37.34,43.23 37.03,43.23 36.12,42.32 36.12,40.49 36.42,40.18 42.22,40.18 45.87,43.84 54.86,43.84 56.69,42.01 56.69,41.25 57.45,40.49 58.37,40.49 59.13,41.25 59.13,51.77 57,53.9 X2.40
P2_G1
  Top 0.152: U4.11 46.94,32.26 55.32,23.88 CONNECTOR_2.2
P2_G1_PIN  (via drill 0.35)
  Top 0.152: v34.75,36.98 37.34,36.98 U4.9 | v26.67,35 26.67,37.74 18.29,46.13 15.39,46.13 15.09,45.82 11.43,45.82 10.67,46.58 10.67,51 11.12,51.46 X2.3
  Bottom 0.152: v34.75,36.98 33.68,38.05 29.72,38.05 v26.67,35
P2_G2
  Top 0.152: U4.14 46.94,39.42 47.24,39.42 51.51,35.15 51.51,30.43 52.88,29.06 55.32,29.06 CONNECTOR_2.6
P2_G2_PIN
  Top 0.152: U4.6 37.49,40.79 41.61,40.79 46.03,45.21 52.27,45.21 58.06,51 58.06,51.92 57.15,52.83 52.88,52.83 51.82,53.9 X2.36
P2_R1
  Top 0.152: CONNECTOR_2.1 56.69,25.09 55.02,25.09 50.9,29.21 50.9,33.33 47.4,36.83 46.94,36.83 U4.12
P2_R1_PIN  (via drill 0.35)
  Top 0.152: v33.38,37.44 34.14,38.2 37.34,38.2 U4.8 | v23.77,34.09 22.86,35 22.86,38.05 16,44.91 7.47,44.91 5.94,46.43 5.94,51 7.77,52.83 15.09,52.83 16.15,53.9 X2.8
  Bottom 0.152: v33.38,37.44 30.02,37.44 26.21,33.63 24.23,33.63 v23.77,34.09
P2_R2
  Top 0.152: U4.15 46.94,40.64 47.4,40.64 51.82,36.22 51.82,30.58 52.27,30.12 56.84,30.12 57.91,29.06 CONNECTOR_2.5
P2_R2_PIN  (via drill 0.35)
  Top 0.152: v42.98,46.13 39.01,42.16 37.49,42.16 U4.5
  Bottom 0.152: v42.98,46.13 48.01,51.16 48.01,51.92 48.77,52.68 53.19,52.68 54.25,51.61 X2.37
ROW_A  (via drill 0.35)
  Top 0.152: v23.47,35.31 23.47,36.83 U2.13
  Bottom 0.152: v23.47,35.31 18.14,35.31 10.67,27.84 10.67,26.92 9.91,26.16 8.99,26.16 7.93,25.09 7.93,17.93 11.58,14.28 11.58,13.36 12.34,12.6 13.26,12.6 14.02,11.84 14.02,10.92 14.63,10.31 19.2,10.31 CONNECTOR_0.9 20.42,11.38 21.79,10.01 46.94,10.01 48.31,11.38 49.23,11.38 CONNECTOR_1.9 49.38,11.38 50.44,10.31 51.51,10.31 53.8,12.6 54.71,12.6 55.47,13.36 55.47,14.28 60.05,18.85 60.05,36.07 58.37,37.74 54.86,37.74 54.25,37.13 54.25,36.07 54.86,35.46 55.63,35.46 57,34.09 57.91,34.09 CONNECTOR_2.9
ROW_A_PIN
  Top 0.152: U2.7 24.84,46.43 24.84,49.94 26.37,51.46 X2.15
ROW_B  (via drill 0.35)
  Top 0.152: U2.12 22.1,36.98 22.1,37.29 21.34,38.05 20.12,38.05 19.51,37.44 19.51,32.26 19.96,31.8 19.96,31.19 19.66,30.89 19.66,26.62 23.32,22.96 23.32,16.87 20.42,13.97 CONNECTOR_0.10 | v52.43,30.89 55.47,33.93 CONNECTOR_2.10
  Bottom 0.152: CONNECTOR_1.10 49.68,13.97 59.13,23.42 59.13,29.36 58.22,30.28 57.45,30.28 56.54,31.19 56.54,32.87 CONNECTOR_2.10 | CONNECTOR_0.10 21.18,13.97 30.17,22.96 44.5,22.96 v52.43,30.89
ROW_B_PIN
  Top 0.152: U2.8 23.62,46.43 23.62,49.63 25.15,51.16 25.15,52.68 26.37,53.9 X2.16
ROW_C  (via drill 0.35)
  Top 0.152: v24.69,35.31 24.69,36.83 U2.14 | v11.43,10.62 11.89,10.62 12.19,10.31 21.79,10.31 22.86,11.38 CONNECTOR_0.11
  Bottom 0.152: 51.82,12.29 53.19,13.67 53.19,16.56 59.74,23.11 59.74,34.7 57.91,36.52 CONNECTOR_2.11 | v24.69,35.31 24.38,35.31 23.77,35.92 16.15,35.92 7.62,27.38 7.62,14.88 9.91,12.6 10.67,12.6 11.43,11.84 v11.43,10.62 | 51.82,12.29 50.14,12.29 49.84,12.6 41.15,12.6 40.23,11.68 40.23,10.92 39.62,10.31 23.93,10.31 22.86,11.38 CONNECTOR_0.11 | 51.82,12.29 CONNECTOR_1.11
ROW_C_PIN  (via drill 0.35)
  Top 0.152: v27.58,43.23 26.06,44.76 26.06,46.43 U2.6 | v31.39,42.62 v30.17,41.4 | v32.31,48.87 32.31,50.7 32.61,51 v32.61,52.38 | v30.17,52.68 28.96,53.9 X2.18
  Bottom 0.152: v27.58,43.23 28.35,43.23 v30.17,41.4 | v31.39,42.62 32.31,42.62 33.98,44.3 33.98,44.91 31.7,47.19 30.17,47.19 29.87,47.5 29.87,48.11 30.63,48.87 v32.31,48.87 | v32.61,52.38 32.31,52.38 32,52.68 v30.17,52.68
ROW_D  (via drill 0.35)
  Top 0.152: v23.47,31.65 23.47,32.26 24.69,33.48 24.69,33.93 25.91,35.15 25.91,36.83 U2.15 | v23.01,26.77 23.01,23.72 24.54,22.2 24.54,15.65 CONNECTOR_0.12 | CONNECTOR_2.12 v54.1,35.31
  Bottom 0.152: v23.01,26.77 23.47,27.23 v23.47,31.65 27.58,31.65 29.41,33.48 52.27,33.48 v54.1,35.31 | CONNECTOR_1.12 51.82,15.65 59.44,23.27 59.44,34.24 58.22,35.46 56.54,35.46 55.47,36.52 CONNECTOR_2.12
ROW_D_PIN
  Top 0.152: U2.5 27.43,46.43 27.43,48.26 30.33,51.16 30.33,51.92 31.24,52.83 32.16,52.83 33.22,53.9 33.98,53.9 X2.22
ROW_E_PIN  (via drill 0.35)
  Top 0.152: v29.11,44.91 29.87,44.91 31.09,46.13 31.09,46.43 U2.2 | X2.10 18.75,53.9 17.83,53.9 16.61,52.68 15.85,52.68 14.94,51.77 14.94,49.94 12.04,47.04 J4.1
  Bottom 0.152: v29.11,44.91 18.59,44.91 18.44,44.76 14.17,44.76 J4.1
SEL_PIN_4
  Bottom 0.152: J2.4 8.23,23.72 8.23,21.74 12.65,17.32 12.65,13.97 CONNECTOR_0.4 13.56,13.97 14.78,12.75 40.39,12.75 41.61,13.97 CONNECTOR_1.4 42.52,13.97 54.86,26.31 55.32,26.31 CONNECTOR_2.4
SEL_PIN_8
  Bottom 0.152: J2.3 17.37,19.46 | 17.37,19.46 17.68,19.15 17.68,13.97 CONNECTOR_0.8 | CONNECTOR_1.8 47.09,13.97 56.54,23.42 56.54,30.43 55.47,31.5 CONNECTOR_2.8 29.41,31.5 17.37,19.46
STROBE
  Top 0.152: U2.3 U2.4 28.5,46.43 28.5,42.77 27.43,41.71 25.15,41.71 22.25,44.6 22.25,46.43 U2.9 22.1,46.43 22.1,46.89 18.75,50.24 17.53,50.24 16.31,51.46 X2.7
STROBE_0
  Top 0.152: U2.11 21.03,36.83 21.03,33.17 23.47,30.73 23.47,27.23 24.38,26.31 24.38,22.81 25.91,21.29 25.91,14.43 25.45,13.97 CONNECTOR_0.14
STROBE_1
  Top 0.152: U2.16 27.28,36.83 27.28,34.54 24.69,31.95 24.69,25.09 28.35,21.44 28.35,18.39 36.73,10.01 57.15,10.01 58.06,10.92 58.06,11.99 57.3,12.75 55.63,12.75 54.41,13.97 CONNECTOR_1.14
STROBE_2  (via drill 0.35)
  Top 0.152: v28.5,39.12 28.5,36.98 U2.17 | v29.57,40.18 29.57,38.66 30.48,37.74 30.48,35.92 v31.39,35
  Bottom 0.152: v29.57,40.18 v28.5,39.12 | v31.39,35 34.75,35 35.97,33.78 49.99,33.78 55.32,39.12 CONNECTOR_2.14
VCC  (via drill 0.35)
  Top 0.152: 32.39,38.96 38.41,38.96 38.71,39.27 40.08,39.27 44.65,34.7 44.65,30.28 U3.1 | 32.39,44.15 30.48,44.15 v30.17,43.84
  Top 0.813: J6.1 11.32,43.61 C6.+ 12.58,42.79 14.59,40.78 C5.1 18.75,40.78 C2.1 | C3.1 48.26,18.96 | 48.26,18.96 C4.1 | C1.1 31.58,18.45 31.42,18.29 29.46,18.29 29.08,18.67 U1.20 U1.1 29.08,30.86 32.39,34.16 U2.20 32.39,38.96 32.39,44.15 U2.1 33.48,46.43 34.29,47.24 37.26,47.24 U4.1 U4.20 | 48.26,18.96 48.09,18.8 45.21,18.8 44.83,19.18 U3.20 U3.1
  Bottom 0.152: v30.17,43.84 4.72,43.84 4.57,43.69 J6.1
  pour Bottom (hatched): -2.79,54.86 -2.79,1.02 1.02,-2.79 65.53,-2.79 67.82,-0.51 67.82,56.39 66.04,58.17 64.52,59.69 2.03,59.69 -0.25,59.69 -2.79,57.15

### Text on the board
tPlace: RX | GND | + / - | GND | 4 | 8 | EN
bStop: VERSION: 0.1 / [ WITHOUT REG VCC IN ] | SAURABH DATTA / ICA-BEIJING-2021 | https://github.com/hzeller/rpi-rgb-led-matrix/